# EAGLE design squall-blees-board (EAGLE 7.2.0)
AUTHOR: BLEES Dev Team; REV: A; TITLE: BLEES Sensor Board
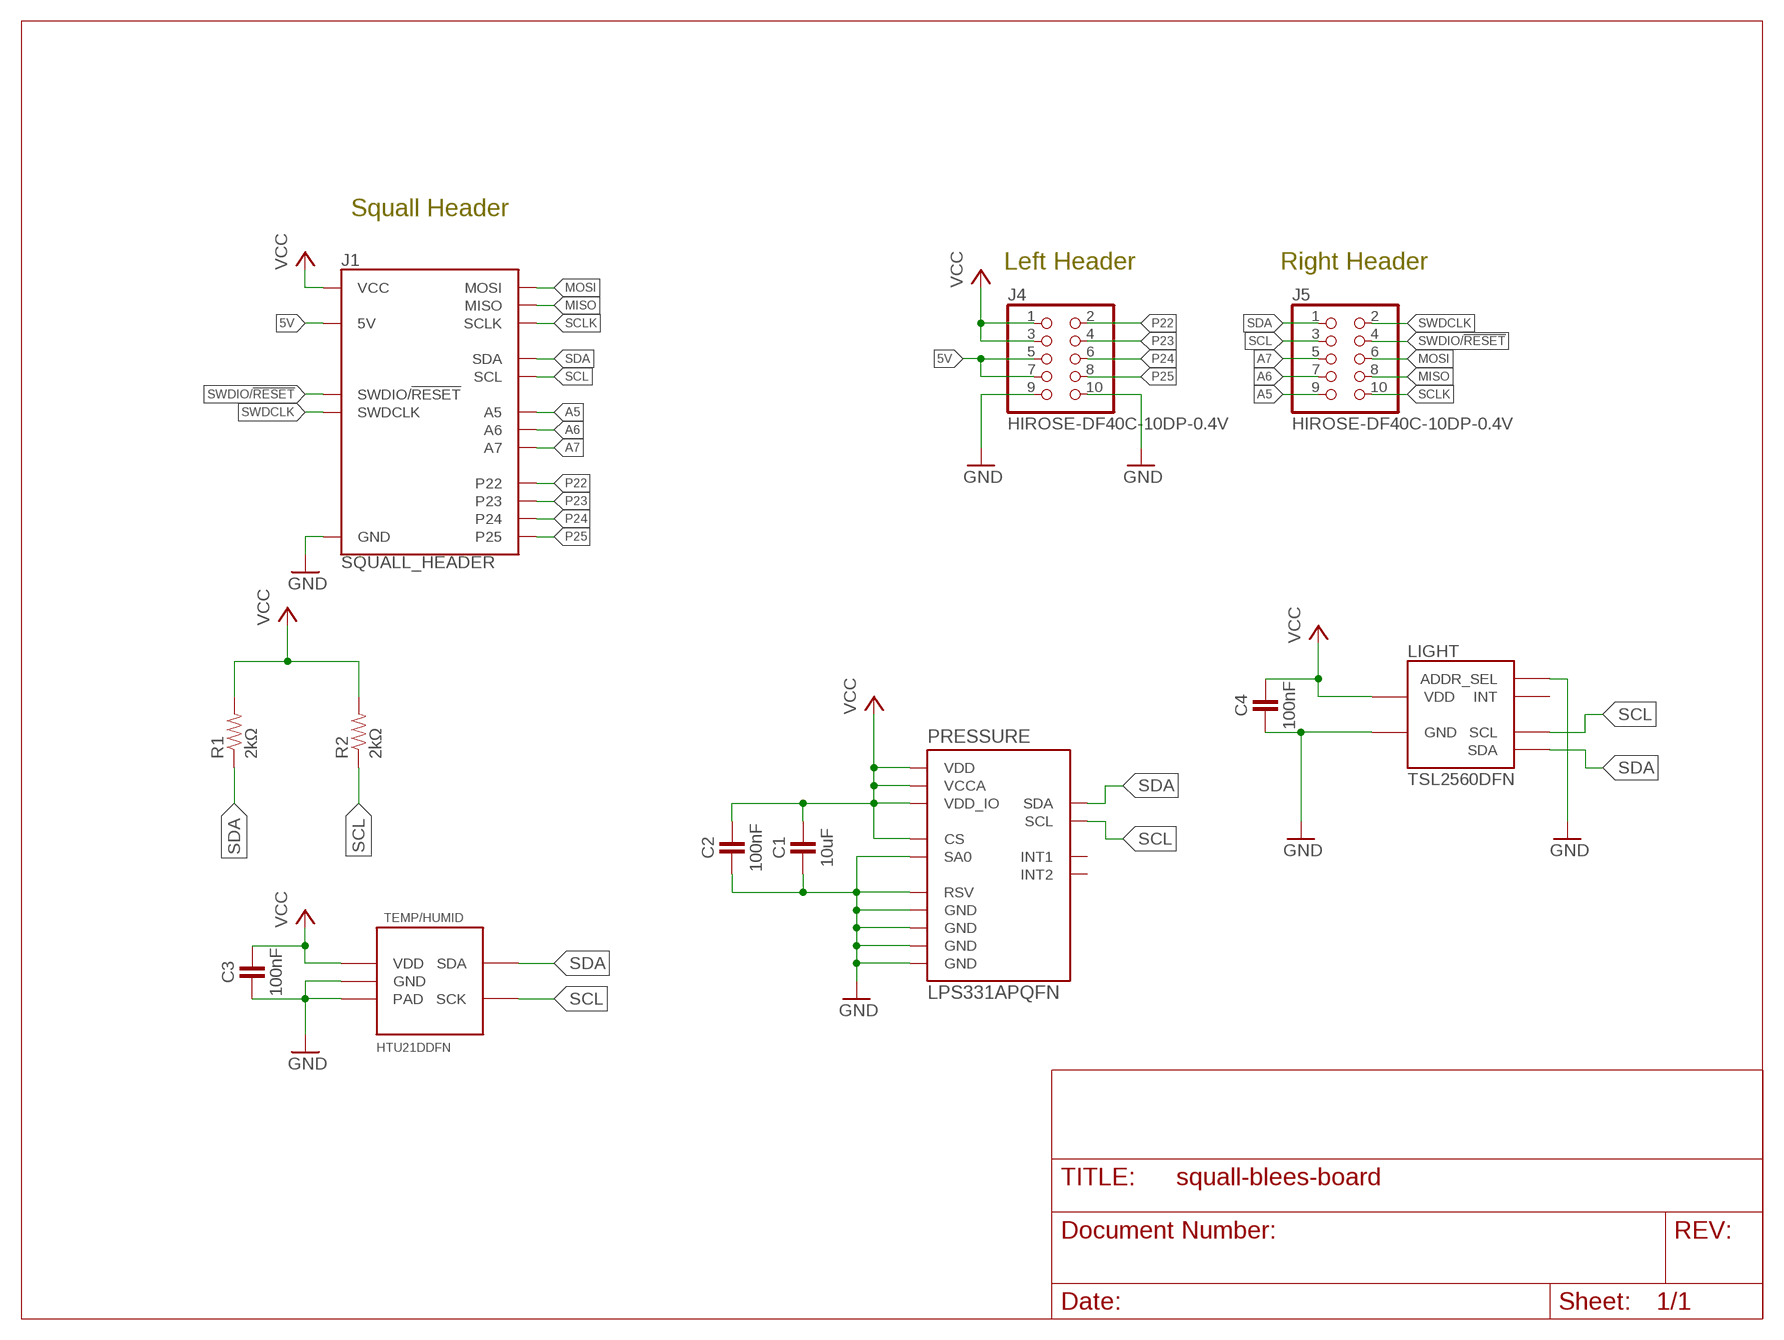
[diagram p0: schematic, sheet 1]

## Parts
C1  10uF  CAPACITOR0603_CAP  [0603_CAP]
C2  100nF  CAPACITOR  [0402_CAP]
C3  100nF  CAPACITOR  [0402_CAP]
C4  100nF  CAPACITOR  [0402_CAP]
J1  SQUALL_HEADER  [SQUALL_HEADER]
J4  HIROSE-DF40C-10DP-0.4V  [2X5/SMD/0.4MM]
J5  HIROSE-DF40C-10DP-0.4V  [2X5/SMD/0.4MM]
LIGHT  TSL2560DFN  [DFN2]
PRESSURE  LPS331APQFN  [HCLGA-16L]
R1  2kΩ  RESISTOR0402_RES  [0402_RES]
R2  2kΩ  RESISTOR0402_RES  [0402_RES]
TEMP/HUMID  HTU21DDFN  [DFN]

## Nets
5V: J1.A5(5V) J1.A7(5V) J4.5 J4.7
A5: J1.B9(A5) J5.9
A6: J1.B7(A6) J5.7
A7: J1.B5(A7) J5.5
GND: C1.2 C2.2 C3.2 C4.2 J1.A9(GND) J1.A10(GND) J4.9 J4.10 LIGHT.2(ADDR_SEL) LIGHT.3(GND) PRESSURE.5(GND) PRESSURE.7(SA0) PRESSURE.10(RSV) PRESSURE.12(GND) PRESSURE.13(GND) PRESSURE.16(GND) TEMP/HUMID.5(GND) TEMP/HUMID.PAD
MISO: J1.B8(MISO) J5.8
MOSI: J1.B6(MOSI) J5.6
P22: J1.A2(P22) J4.2
P23: J1.A4(P23) J4.4
P24: J1.A6(P24) J4.6
P25: J1.A8(P25) J4.8
SCL: J1.B3(SCL) J5.3 LIGHT.4(SCL) PRESSURE.4(SCL) R2.1 TEMP/HUMID.1(SCK)
SCLK: J1.B10(SCLK) J5.10
SDA: J1.B1(SDA) J5.1 LIGHT.6(SDA) PRESSURE.6(SDA) R1.1 TEMP/HUMID.6(SDA)
SWDCLK: J1.B2(SWDCLK) J5.2
SWDIO/!RESET: J1.B4(SWDIO/!RESET) J5.4
VCC: C1.1 C2.1 C3.1 C4.1 J1.A1(VCC) J1.A3(VCC) J4.1 J4.3 LIGHT.1(VDD) PRESSURE.1(VDD_IO) PRESSURE.8(CS) PRESSURE.14(VDD) PRESSURE.15(VCCA) R1.2 R2.2 TEMP/HUMID.2(VDD)
Unconnected: LIGHT.5(INT) PRESSURE.9(INT2) PRESSURE.11(INT1)

## Notes on the sheet
- Squall Header
- Left Header | Right Header

## Library data of the parts
C1-C4 = passives:CAPACITOR: 0402 Capacitor
J1 = squall:SQUALL_HEADER: Header for a sensor board on top of the Squall BLE tag board. Requires two DF40C-10DS-0.4V(51).; DIGIKEY: H11617CT-ND
J4 J5 = headers:HIROSE-DF40C-10DP-0.4V: DF40 Series Header - 0.4MM Pitch; DIGIKEY: H11616CT-ND; MOUSER: 798-DF40C10DP0.4V51; NEWARK: 68X2585
LIGHT = blees:TSL2560: TSL2560 light to digital converter, written by BLEES EECS 373.
PRESSURE = blees:LPS331AP: LPS331AP pressure sensor device designed by BLEES EECS 373
R1 R2 = passives:RESISTOR: Resistor Basic schematic elements and footprints for 0603, 1206, and PTH resistors.
TEMP/HUMID = blees:HTU21D: This is the HTU21D Temp/Humidity sensor made by BLEES EECS 373.

## Board
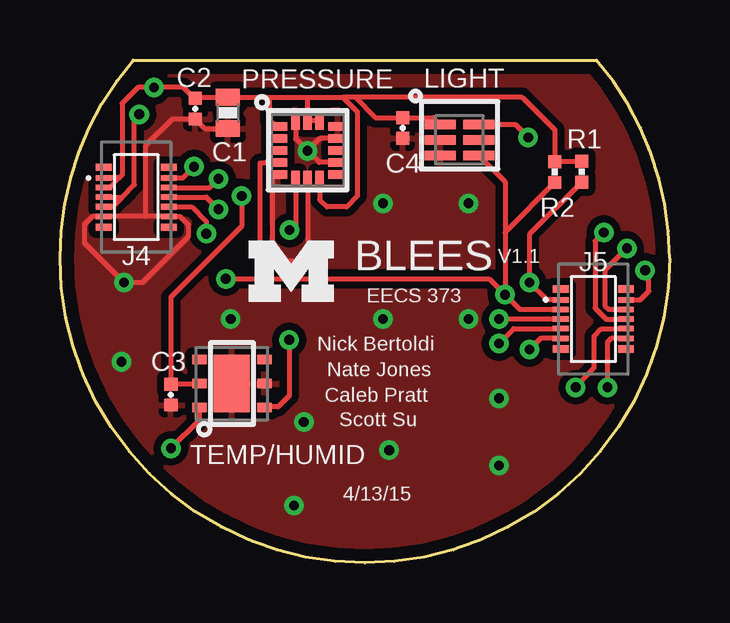
[diagram p1: board, top side]
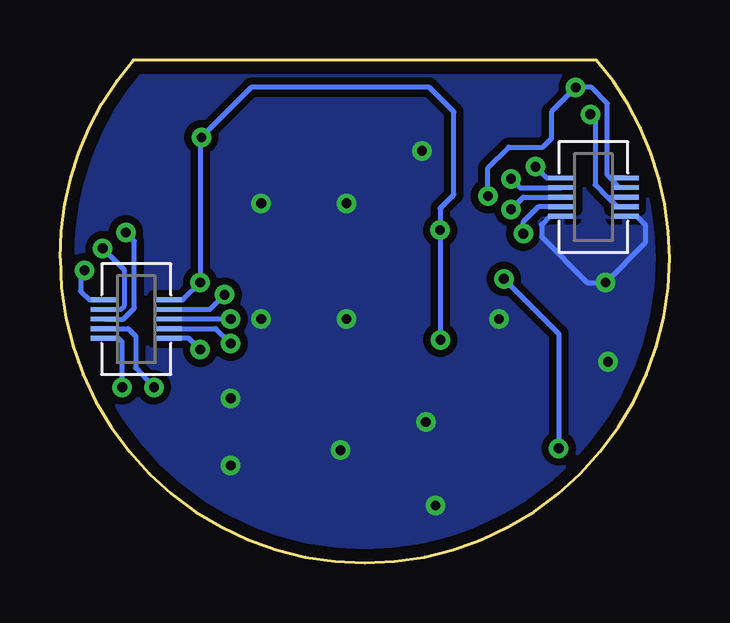
[diagram p2: board, bottom side, seen from below]

Size 25.4 x 20.95 mm. Coordinates in mm from the lower left corner, seen from the top.
Outline: 25.4,12.7 arc-180 0,12.7 arc-41 3.05,20.95 22.35,20.95 arc-41 25.4,12.7
Copper layers (1*16): Top 0.0178mm / dielectric 59mil / Bottom 0.0178mm
Design rules "sunstone-2lyr_v1.0.0.3 *": minimum track width 6mil, minimum drill 14mil, track to track 5mil, track to pad 5mil, pad to pad 5mil, via to via 5mil, smd to smd 5mil, copper to edge 20mil, drill to drill 16mil, minimum pad ring 8mil, minimum via ring 8mil, stop-mask expansion 3mil, vias tented up to drill 0mil, thermal gap 10mil

### Footprints (pad centres in the part's own frame; a part is rotated, then mirrored left to right if it is on the bottom)
0603_CAP = smd 0.7 x 1: 1 -0.65,0; 2 0.65,0
0402_CAP = smd 0.536 x 0.546: 1 -0.433,0; 2 0.433,0
SQUALL_HEADER = smd 1.14 x 0.2 bottom: A1 -10.845,3.34; A2 -8.205,3.34; A3 -10.845,2.94; A4 -8.205,2.94; A5 -10.845,2.54; A6 -8.205,2.54; A7 -10.845,2.14; A8 -8.205,2.14; A9 -10.845,1.74; A10 -8.205,1.74; B1 8.205,-1.74; B2 10.845,-1.74; B3 8.205,-2.14; B4 10.845,-2.14; B5 8.205,-2.54; B6 10.845,-2.54; B7 8.205,-2.94; B8 10.845,-2.94; B9 8.205,-3.34; B10 10.845,-3.34
2X5/SMD/0.4MM = smd 0.66 x 0.23: 1 -1.355,0.8; 2 1.355,0.8; 3 -1.355,0.4; 4 1.355,0.4; 5 -1.355,0; 6 1.355,0; 7 -1.355,-0.4; 8 1.355,-0.4; 9 -1.355,-0.8; 10 1.355,-0.8 | smd 0.66 x 0.3: A -1.355,1.25; B 1.355,1.25; C -1.355,-1.25; D 1.355,-1.25
DFN2 = smd 1.3 x 0.4: 1 -0.8,0.65; 2 -0.8,0; 3 -0.8,-0.65; 4 0.8,-0.65; 5 0.8,0; 6 0.8,0.65
HCLGA-16L = smd 0.8 x 0.35: 1 -1.25,1; 2 -1.25,0.5; 3 -1.25,0; 4 -1.25,-0.5; 5 -1.25,-1; 9 1.25,-1; 10 1.25,-0.5; 11 1.25,0; 12 1.25,0.5; 13 1.25,1 | smd 0.35 x 0.8: 6 -0.5,-1.25; 7 0,-1.25; 8 0.5,-1.25; 14 0.5,1.25; 15 0,1.25; 16 -0.5,1.25
0402_RES = smd 0.536 x 0.546: 1 -0.433,0; 2 0.433,0
DFN = smd 0.6 x 0.4: 1 -1.35,-1; 2 -1.35,0; 3 -1.35,1; 4 1.35,1; 5 1.35,0; 6 1.35,-1 | smd 1.5 x 2.4: PAD 0,0

### Placement (x,y rotation side)
C1  6.99,18.75 270 top
C2  5.64,18.93 270 top
C3  4.62,7.01 270 top
C4  14.27,18.12 270 top
J1  12.7,12.7 0 top
J4  3.18,15.24 0 top
J5  22.23,10.16 0 top
LIGHT  16.64,17.62 0 top
PRESSURE  10.32,17.19 0 top
R1  21.74,16.3 90 top
R2  20.62,16.29 90 top
TEMP/HUMID  7.16,7.47 0 top

### Tracks (layer width: path | path; a pad name or v marks a point on that pad's centre or on a via)
5V  (via drill 0.41)
  Top 0.203: J4.5 2.59,15.24 | 2.59,15.24 3.1,15.75 3.1,18.49 v3.3,18.69 | J4.7 2.19,14.84 2.59,15.24
  Bottom 0.203: v3.3,18.69 3.1,18.49 3.1,15.75 2.59,15.24 | 2.59,15.24 J1.A5 | J1.A7 2.19,14.84 2.59,15.24
A5  (via drill 0.41)
  Top 0.203: J5.9 20.03,9.36 v19.56,8.89
  Bottom 0.203: v19.56,8.89 20.03,9.36 J1.B9
A6  (via drill 0.41)
  Top 0.203: v18.29,9.14 18.9,9.76 J5.7
  Bottom 0.203: J1.B7 18.9,9.76 v18.29,9.14
A7  (via drill 0.41)
  Top 0.203: J5.5 v18.29,10.16
  Bottom 0.203: v18.29,10.16 J1.B5
GND  (via drill 0.41)
  Top 0.203: 3.56,14.44 J4.10 4.99,14.44 5.33,14.1 5.33,13.59 3.43,11.68 v2.67,11.68 1.02,13.34 1.02,14.1 1.36,14.44 J4.9 3.56,14.44 | 3.56,14.44 3.56,17.37 4.68,18.5 C2.2 6.03,18.1 C1.2 | PRESSURE.5 8.84,16.16 8.84,13.21 9.45,12.6 9.96,12.6 10.32,12.96 PRESSURE.7 | PRESSURE.16 9.82,17.66 v10.31,17.17 | PRESSURE.10 10.79,16.69 v10.31,17.17 | PRESSURE.12 10.83,17.69 v10.31,17.17
  Bottom 0.203: J1.A9 1.36,14.44 1.02,14.1 1.02,13.34 v2.67,11.68 3.43,11.68 5.33,13.59 5.33,14.1 4.99,14.44 J1.A10
  other vias: 13.46,14.99 17.02,14.99 13.46,10.16 17.02,10.16 18.29,6.86 10.16,5.87 13.72,4.7 18.29,4.06 9.75,2.39 2.57,8.38 7.11,10.16
  pour Top (isolate 0.305): 25.4,12.7 arc-180 0,12.7 arc-41 3.05,20.95 22.35,20.95 arc-41
  pour Bottom (isolate 0.305): 25.4,12.7 arc-180 0,12.7 arc-41 3.05,20.95 22.35,20.95 arc-41
MISO  (via drill 0.41)
  Top 0.203: v21.49,7.32 22.25,8.13 22.25,9.45 22.55,9.75 J5.8
  Bottom 0.203: J1.B8 22.56,9.76 22.25,9.45 22.25,8.13 v21.49,7.32
MOSI  (via drill 0.41)
  Top 0.203: v22.66,13.77 22.3,13.41 22.3,10.62 22.76,10.16 J5.6
  Bottom 0.203: J1.B6 22.76,10.16 22.3,10.62 22.3,13.41 v22.66,13.77
P22  (via drill 0.41)
  Top 0.203: J4.2 5.12,16.04 v5.59,16.51
  Bottom 0.203: v5.59,16.51 5.12,16.04 J1.A2
P23  (via drill 0.41)
  Top 0.203: J4.4 6.24,15.64 v6.6,16
  Bottom 0.203: v6.6,16 6.24,15.64 J1.A4
P24  (via drill 0.41)
  Top 0.203: J4.6 6.1,15.24 v6.6,14.73
  Bottom 0.203: v6.6,14.73 6.1,15.24 J1.A6
P25  (via drill 0.41)
  Top 0.203: J4.8 5.48,14.84 6.1,14.22 v6.1,13.72
  Bottom 0.203: J1.A8 5.48,14.84 6.1,14.22 v6.1,13.72
SCL  (via drill 0.41)
  Top 0.203: v18.54,11.18 19.16,10.56 J5.3 | LIGHT.4 18.54,15.87 18.54,13.78 | 18.54,13.78 v18.54,11.18 | 8.56,16.69 PRESSURE.4 8.79,16.66 8.33,16.66 8.33,11.84 | v6.91,11.84 8.33,11.84 | 8.33,11.84 17.88,11.84 v18.54,11.18 | R2.1 18.54,13.78 | v4.62,4.78 5.81,5.96 TEMP/HUMID.1
  Bottom 0.203: J1.B3 19.16,10.56 v18.54,11.18 | v6.91,11.84 4.62,9.55 v4.62,4.78
SCLK  (via drill 0.41)
  Top 0.203: J5.10 22.97,9.36 22.81,9.2 v22.81,7.32
  Bottom 0.203: v22.81,7.32 22.81,9.2 22.97,9.36 J1.B10
SDA  (via drill 0.41)
  Top 0.203: J5.1 20.28,10.96 v19.56,11.68 19.56,13.68 R1.1 | v19.51,17.73 18.96,18.27 LIGHT.6 17.53,18.19 | v9.55,9.3 9.55,6.96 9.09,6.5 8.55,6.5 TEMP/HUMID.6 | PRESSURE.6 9.82,13.87 v9.56,13.87
  Bottom 0.203: J1.B1 20.28,10.96 v19.56,11.68 19.56,17.68 v19.51,17.73 17.42,19.81 10.01,19.81 8.99,18.8 8.99,15.34 9.56,14.77 v9.56,13.87 9.56,9.31 v9.55,9.3
SWDCLK  (via drill 0.41)
  Top 0.203: J5.2 24.17,10.96 24.54,11.33 24.54,12.04 v24.38,12.19
  Bottom 0.203: v24.38,12.19 24.54,12.04 24.54,11.33 24.17,10.96 J1.B2
SWDIO/!RESET  (via drill 0.41)
  Top 0.203: v23.62,13.11 22.71,12.19 22.71,10.72 22.86,10.57 J5.4
  Bottom 0.203: J1.B4 22.87,10.56 22.71,10.72 22.71,12.19 v23.62,13.11
VCC  (via drill 0.41)
  Top 0.203: 8.74,19.4 C1.1 5.68,19.4 C2.1 5.59,19.36 5.13,19.81 v3.91,19.81 3.25,19.81 2.59,19.15 2.59,16.15 2.48,16.04 | 8.74,19.4 10.36,19.4 | 10.36,19.4 11.79,19.4 | PRESSURE.1 8.74,18.42 8.74,19.4 | 2.48,16.04 J4.1 | J4.3 2.08,15.64 2.48,16.04 | LIGHT.1 15.56,18.55 C4.1 13.15,18.55 12.3,19.4 | 12.3,19.4 19.26,19.4 20.62,18.04 R2.2 20.63,16.73 R1.2 | 12.3,19.4 11.79,19.4 | v7.57,15.29 7.57,14.02 4.62,11.07 C3.1 4.65,7.47 TEMP/HUMID.2 | 11.79,19.4 12.39,18.79 12.39,15.29 11.94,14.83 11.12,14.83 10.82,15.14 PRESSURE.8 | 10.36,19.4 10.32,19.36 PRESSURE.15 PRESSURE.14
  Bottom 0.203: J1.A1 2.48,16.04 | 2.48,16.04 2.59,16.15 2.59,19.15 3.25,19.81 v3.91,19.81 4.93,18.8 4.93,17.68 5.28,17.32 6.71,17.32 7.57,16.46 v7.57,15.29 | J1.A3 2.08,15.64 2.48,16.04

### Text on the board
tPlace: BLEES | V1.1 | EECS 373 | Nick Bertoldi | Nate Jones | Caleb Pratt | Scott Su | 4/13/15